# Altium schematic sheet P03_AM335x 1_3, JTAG.SchDoc
size 513 x 386 mm
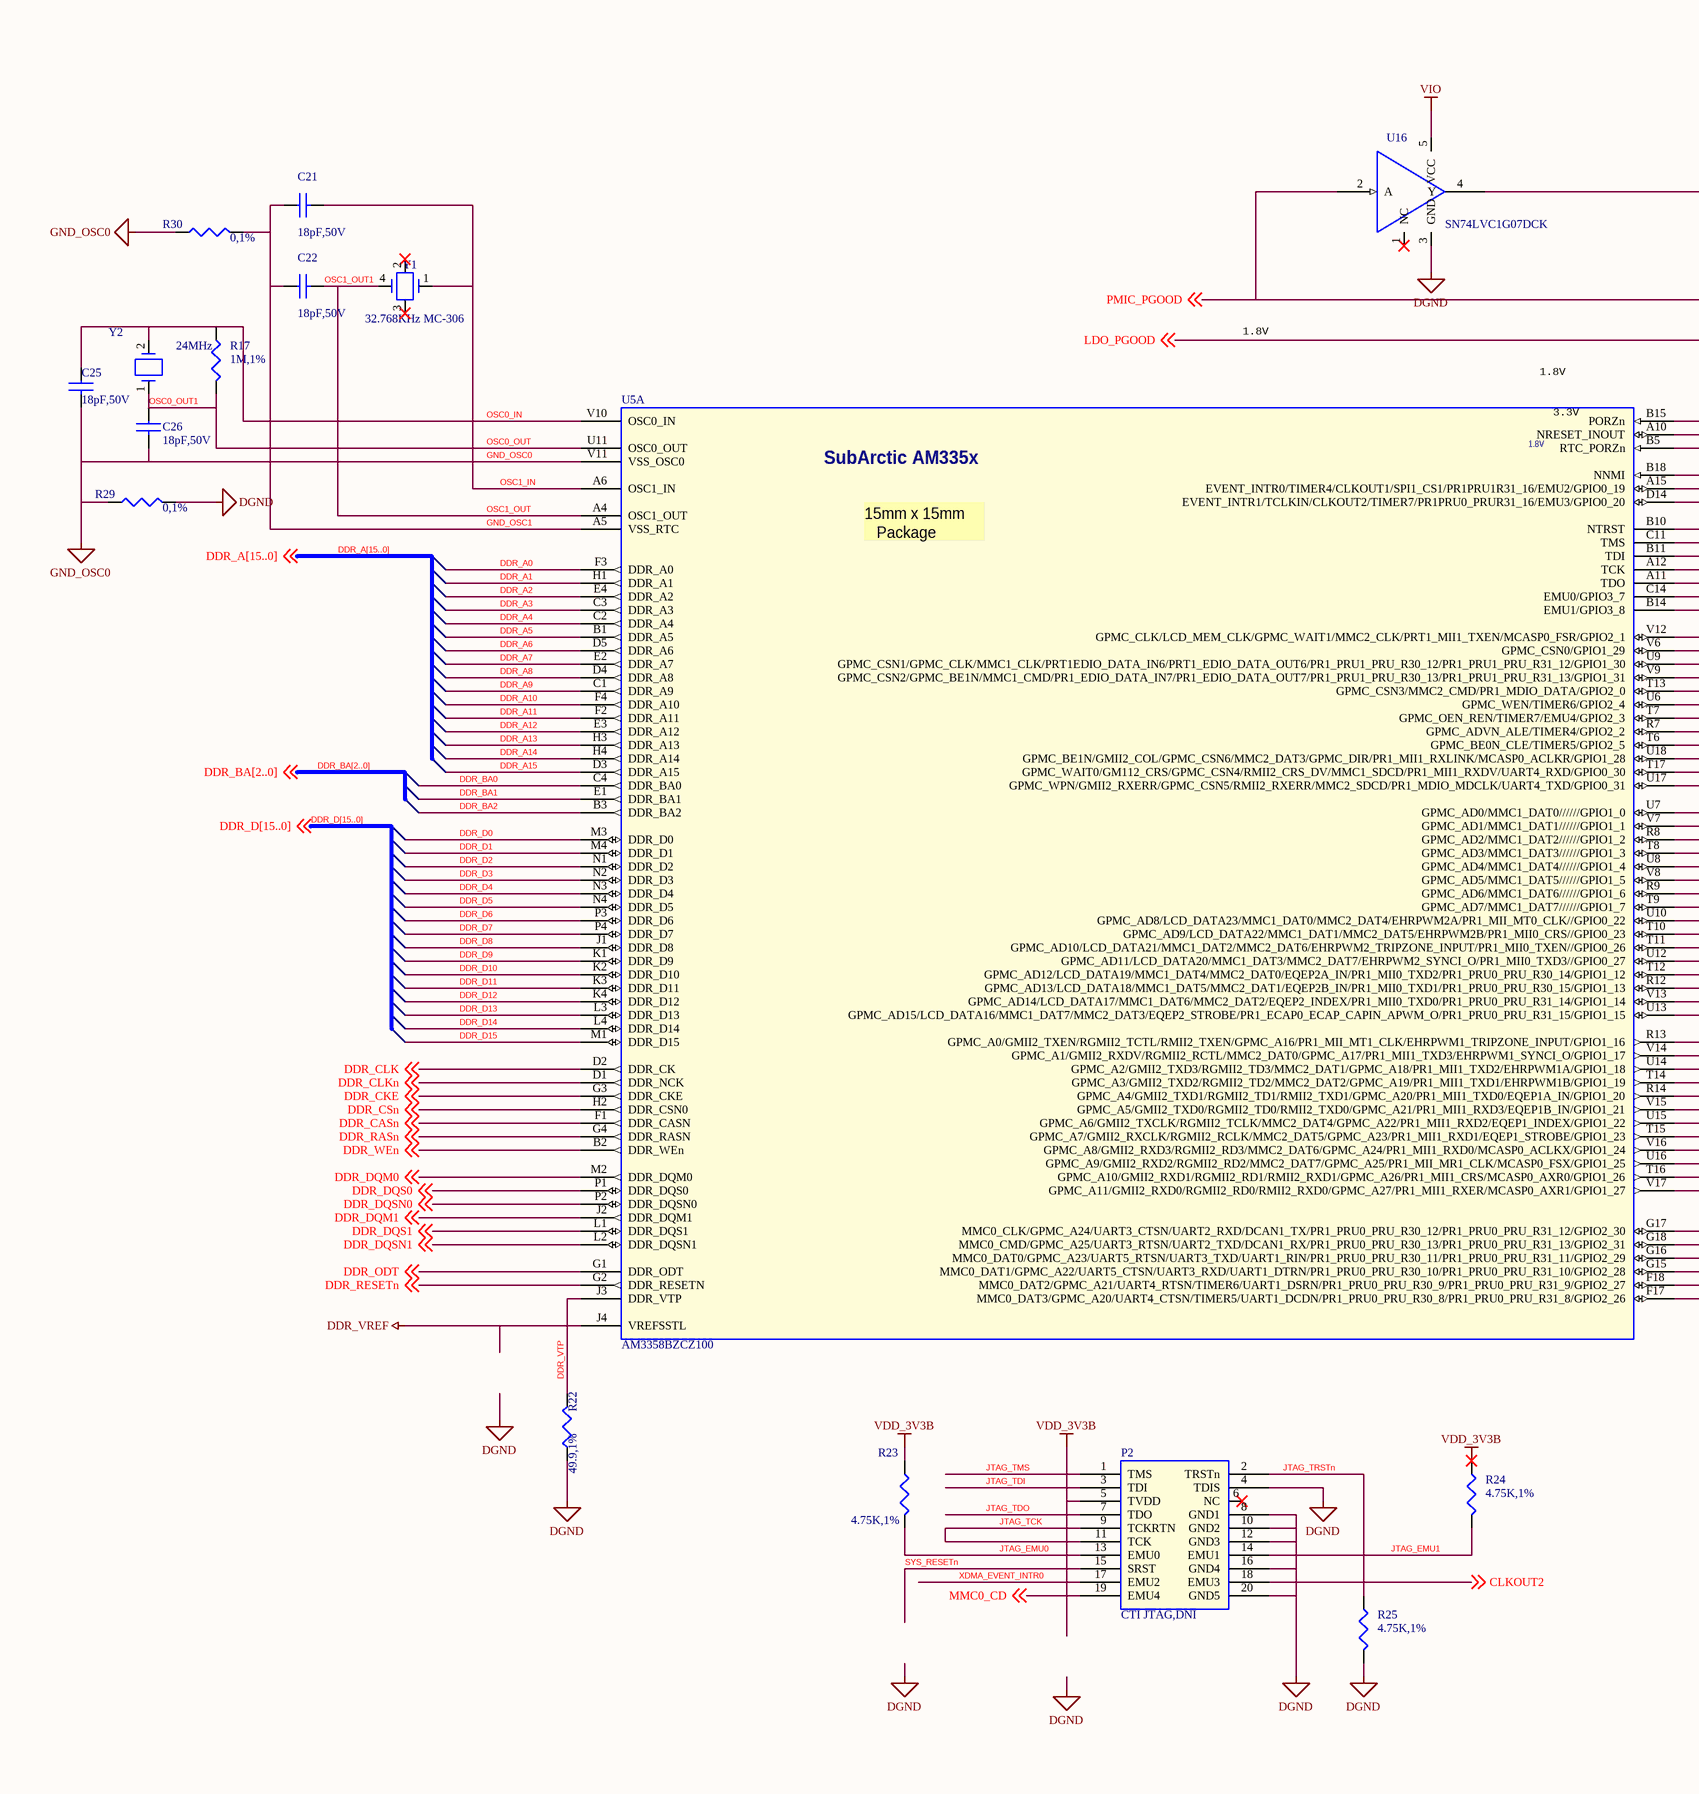
[diagram p0: P03_AM335x 1_3, JTAG.SchDoc, left]
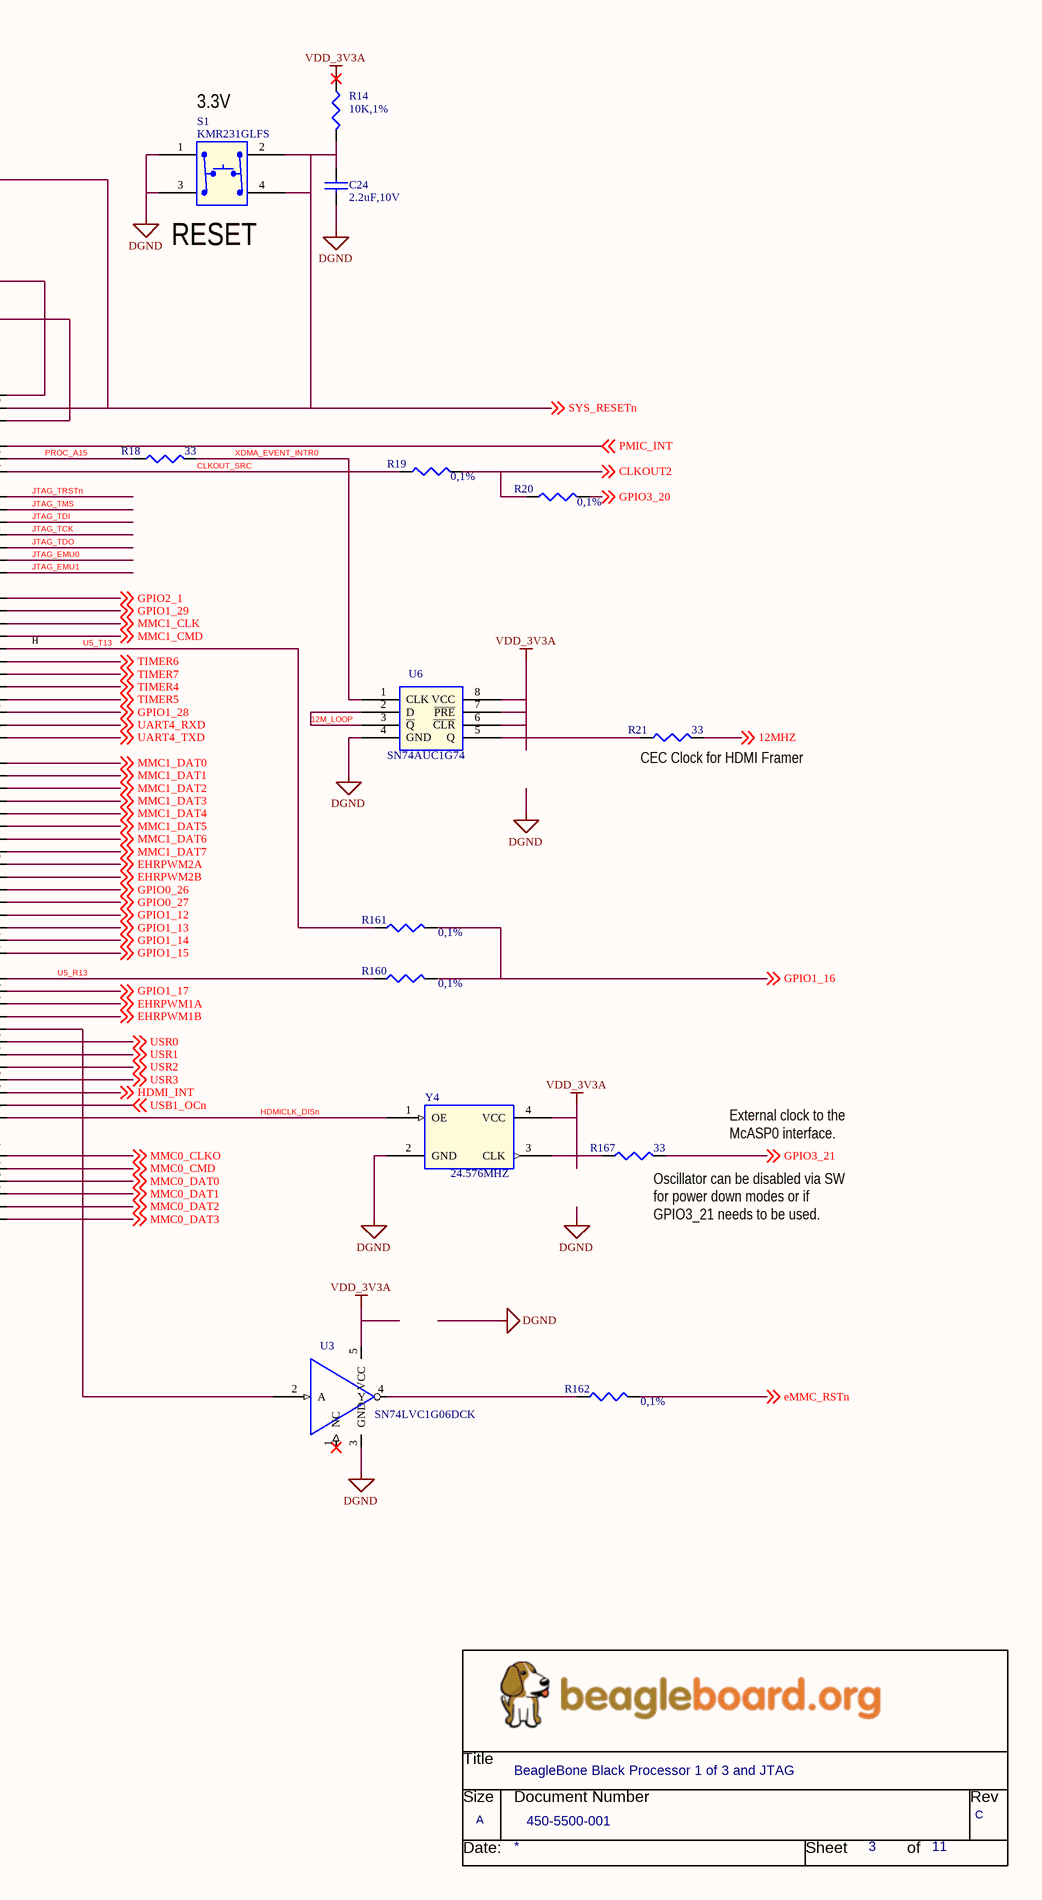
[diagram p1: P03_AM335x 1_3, JTAG.SchDoc, right]

## Parts
*  Page Count: 11  Page Number: 3  Page Size: A  Title: BeagleBone Black Processor 1 of 3 and JTAG  RevCode: C  Doc: 450-5500-001  (hidden comment: BeagleBoard_org)  (graphical)
C21  18pF,50V  [402]
C22  18pF,50V  [402]
C24  2.2uF,10V  [402]
C25  18pF,50V  [402]
C26  18pF,50V  [402]
P2  CTI JTAG,DNI  [header10x2]
R14  10K,1%  [402]
R17  1M,1%  [402]
R18  33  [r402-25rd]
R19  0,1%  [402]
R20  0,1%  [402]
R21  33  [r402-25rd]
R22  49.9,1%  [r402-25rd]
R23  4.75K,1%  [402]
R24  4.75K,1%  [402]
R25  4.75K,1%  [402]
R29  0,1%  [402]
R30  0,1%  [402]
R160  0,1%  [402]
R161  0,1%  [402]
R162  0,1%  [402]
R167  33  [r402-25rd]
S1  KMR231GLFS  [SM-SW-SPST-4-4]
U3  SN74LVC1G06DCK  [DCK5_2P15X1P4]
U5  AM3358BZCZ100  [am33xx_15x15]  (part A of 3)
U6  SN74AUC1G74  [SOP8_DCT]
U16  SN74LVC1G07DCK  [DCK5_2P15X1P4]
Y1  32.768KHz MC-306  [MC-306]
Y2  24MHz  [SM_CRY_SCC18]
Y4  24.576MHZ  [ecs_smd3_2x5mm]

## Nets
DDR_VREF: U5.J4(VREFSSTL)
DGND: C24.2 P2.4(TDIS) P2.8(GND1) P2.10(GND2) P2.12(GND3) P2.16(GND4) P2.20(GND5) R22.1 R25.2 R29.2 S1.1(A1) S1.3(A2) U3.3(GND) U6.4(GND) U16.3(GND) Y4.2(GND)
GND_OSC0: C25.2 C26.2 R29.1 R30.1 U5.V11(VSS_OSC0)
VDD_3V3A: R14.1 U3.5(VCC) U6.6(~{CLR}) U6.7(~{PRE}) U6.8(VCC) Y4.4(VCC)
VDD_3V3B: P2.5(TVDD) R23.1 R24.1
VIO: U16.5(VCC)
12M_LOOP: U6.2(D) U6.3(~{Q})
12MHZ: R21.2 ; off-sheet 12MHZ
CLKOUT2: P2.18(EMU3) R19.2 R20.1 ; off-sheet CLKOUT2
CLKOUT_SRC: R19.1 U5.D14(EVENT_INTR1/TCLKIN/CLKOUT2/TIMER7/PR1PRU0_PRUR31_16/EMU3/GPIO0_20)
DDR_A0: U5.F3(DDR_A0)
DDR_A1: U5.H1(DDR_A1)
DDR_A2: U5.E4(DDR_A2)
DDR_A3: U5.C3(DDR_A3)
DDR_A4: U5.C2(DDR_A4)
DDR_A5: U5.B1(DDR_A5)
DDR_A6: U5.D5(DDR_A6)
DDR_A7: U5.E2(DDR_A7)
DDR_A8: U5.D4(DDR_A8)
DDR_A9: U5.C1(DDR_A9)
DDR_A10: U5.F4(DDR_A10)
DDR_A11: U5.F2(DDR_A11)
DDR_A12: U5.E3(DDR_A12)
DDR_A13: U5.H3(DDR_A13)
DDR_A14: U5.H4(DDR_A14)
DDR_A15: U5.D3(DDR_A15)
DDR_BA0: U5.C4(DDR_BA0)
DDR_BA1: U5.E1(DDR_BA1)
DDR_BA2: U5.B3(DDR_BA2)
DDR_CASn: U5.F1(DDR_CASN) ; off-sheet DDR_CASn
DDR_CKE: U5.G3(DDR_CKE) ; off-sheet DDR_CKE
DDR_CLK: U5.D2(DDR_CK) ; off-sheet DDR_CLK
DDR_CLKn: U5.D1(DDR_NCK) ; off-sheet DDR_CLKn
DDR_CSn: U5.H2(DDR_CSN0) ; off-sheet DDR_CSn
DDR_D0: U5.M3(DDR_D0)
DDR_D1: U5.M4(DDR_D1)
DDR_D2: U5.N1(DDR_D2)
DDR_D3: U5.N2(DDR_D3)
DDR_D4: U5.N3(DDR_D4)
DDR_D5: U5.N4(DDR_D5)
DDR_D6: U5.P3(DDR_D6)
DDR_D7: U5.P4(DDR_D7)
DDR_D8: U5.J1(DDR_D8)
DDR_D9: U5.K1(DDR_D9)
DDR_D10: U5.K2(DDR_D10)
DDR_D11: U5.K3(DDR_D11)
DDR_D12: U5.K4(DDR_D12)
DDR_D13: U5.L3(DDR_D13)
DDR_D14: U5.L4(DDR_D14)
DDR_D15: U5.M1(DDR_D15)
DDR_DQM0: U5.M2(DDR_DQM0) ; off-sheet DDR_DQM0
DDR_DQM1: U5.J2(DDR_DQM1) ; off-sheet DDR_DQM1
DDR_DQS0: U5.P1(DDR_DQS0) ; off-sheet DDR_DQS0
DDR_DQS1: U5.L1(DDR_DQS1) ; off-sheet DDR_DQS1
DDR_DQSN0: U5.P2(DDR_DQSN0) ; off-sheet DDR_DQSN0
DDR_DQSN1: U5.L2(DDR_DQSN1) ; off-sheet DDR_DQSN1
DDR_ODT: U5.G1(DDR_ODT) ; off-sheet DDR_ODT
DDR_RASn: U5.G4(DDR_RASN) ; off-sheet DDR_RASn
DDR_RESETn: U5.G2(DDR_RESETN) ; off-sheet DDR_RESETn
DDR_VTP: R22.2 U5.J3(DDR_VTP)
DDR_WEn: U5.B2(DDR_WEn) ; off-sheet DDR_WEn
EHRPWM1A: U5.U14(GPMC_A2/GMII2_TXD3/RGMII2_TD3/MMC2_DAT1/GPMC_A18/PR1_MII1_TXD2/EHRPWM1A/GPIO1_18) ; off-sheet EHRPWM1A
EHRPWM1B: U5.T14(GPMC_A3/GMII2_TXD2/RGMII2_TD2/MMC2_DAT2/GPMC_A19/PR1_MII1_TXD1/EHRPWM1B/GPIO1_19) ; off-sheet EHRPWM1B
EHRPWM2A: U5.U10(GPMC_AD8/LCD_DATA23/MMC1_DAT0/MMC2_DAT4/EHRPWM2A/PR1_MII_MT0_CLK//GPIO0_22) ; off-sheet EHRPWM2A
EHRPWM2B: U5.T10(GPMC_AD9/LCD_DATA22/MMC1_DAT1/MMC2_DAT5/EHRPWM2B/PR1_MII0_CRS//GPIO0_23) ; off-sheet EHRPWM2B
eMMC_RSTn: R162.2 ; off-sheet eMMC_RSTn
GND_OSC1: C21.1 C22.1 R30.2 U5.A5(VSS_RTC)
GPIO0_26: U5.T11(GPMC_AD10/LCD_DATA21/MMC1_DAT2/MMC2_DAT6/EHRPWM2_TRIPZONE_INPUT/PR1_MII0_TXEN//GPIO0_26) ; off-sheet GPIO0_26
GPIO0_27: U5.U12(GPMC_AD11/LCD_DATA20/MMC1_DAT3/MMC2_DAT7/EHRPWM2_SYNCI_O/PR1_MII0_TXD3//GPIO0_27) ; off-sheet GPIO0_27
GPIO1_12: U5.T12(GPMC_AD12/LCD_DATA19/MMC1_DAT4/MMC2_DAT0/EQEP2A_IN/PR1_MII0_TXD2/PR1_PRU0_PRU_R30_14/GPIO1_12) ; off-sheet GPIO1_12
GPIO1_13: U5.R12(GPMC_AD13/LCD_DATA18/MMC1_DAT5/MMC2_DAT1/EQEP2B_IN/PR1_MII0_TXD1/PR1_PRU0_PRU_R30_15/GPIO1_13) ; off-sheet GPIO1_13
GPIO1_14: U5.V13(GPMC_AD14/LCD_DATA17/MMC1_DAT6/MMC2_DAT2/EQEP2_INDEX/PR1_MII0_TXD0/PR1_PRU0_PRU_R31_14/GPIO1_14) ; off-sheet GPIO1_14
GPIO1_15: U5.U13(GPMC_AD15/LCD_DATA16/MMC1_DAT7/MMC2_DAT3/EQEP2_STROBE/PR1_ECAP0_ECAP_CAPIN_APWM_O/PR1_PRU0_PRU_R31_15/GPIO1_15) ; off-sheet GPIO1_15
GPIO1_16: R160.2 R161.2 ; off-sheet GPIO1_16
GPIO1_17: U5.V14(GPMC_A1/GMII2_RXDV/RGMII2_RCTL/MMC2_DAT0/GPMC_A17/PR1_MII1_TXD3/EHRPWM1_SYNCI_O/GPIO1_17) ; off-sheet GPIO1_17
GPIO1_28: U5.U18(GPMC_BE1N/GMII2_COL/GPMC_CSN6/MMC2_DAT3/GPMC_DIR/PR1_MII1_RXLINK/MCASP0_ACLKR/GPIO1_28) ; off-sheet GPIO1_28
GPIO1_29: U5.V6(GPMC_CSN0/GPIO1_29) ; off-sheet GPIO1_29
GPIO2_1: U5.V12(GPMC_CLK/LCD_MEM_CLK/GPMC_WAIT1/MMC2_CLK/PRT1_MII1_TXEN/MCASP0_FSR/GPIO2_1) ; off-sheet GPIO2_1
GPIO3_20: R20.2 ; off-sheet GPIO3_20
GPIO3_21: R167.2 ; off-sheet GPIO3_21
HDMI_INT: U5.U16(GPMC_A9/GMII2_RXD2/RGMII2_RD2/MMC2_DAT7/GPMC_A25/PR1_MII_MR1_CLK/MCASP0_FSX/GPIO1_25) ; off-sheet HDMI_INT
HDMICLK_DISn: U5.V17(GPMC_A11/GMII2_RXD0/RGMII2_RD0/RMII2_RXD0/GPMC_A27/PR1_MII1_RXER/MCASP0_AXR1/GPIO1_27) Y4.1(OE)
JTAG_EMU0: P2.13(EMU0) R23.2 U5.C14(EMU0/GPIO3_7)
JTAG_EMU1: P2.14(EMU1) R24.2 U5.B14(EMU1/GPIO3_8)
JTAG_TCK: P2.9(TCKRTN) P2.11(TCK) U5.A12(TCK)
JTAG_TDI: P2.3(TDI) U5.B11(TDI)
JTAG_TDO: P2.7(TDO) U5.A11(TDO)
JTAG_TMS: P2.1(TMS) U5.C11(TMS)
JTAG_TRSTn: P2.2(TRSTn) R25.1 U5.B10(NTRST)
LDO_PGOOD: U5.B5(RTC_PORZn) ; off-sheet LDO_PGOOD
MMC0_CD: P2.19(EMU4) ; off-sheet MMC0_CD
MMC0_CLKO: U5.G17(MMC0_CLK/GPMC_A24/UART3_CTSN/UART2_RXD/DCAN1_TX/PR1_PRU0_PRU_R30_12/PR1_PRU0_PRU_R31_12/GPIO2_30) ; off-sheet MMC0_CLKO
MMC0_CMD: U5.G18(MMC0_CMD/GPMC_A25/UART3_RTSN/UART2_TXD/DCAN1_RX/PR1_PRU0_PRU_R30_13/PR1_PRU0_PRU_R31_13/GPIO2_31) ; off-sheet MMC0_CMD
MMC0_DAT0: U5.G16(MMC0_DAT0/GPMC_A23/UART5_RTSN/UART3_TXD/UART1_RIN/PR1_PRU0_PRU_R30_11/PR1_PRU0_PRU_R31_11/GPIO2_29) ; off-sheet MMC0_DAT0
MMC0_DAT1: U5.G15(MMC0_DAT1/GPMC_A22/UART5_CTSN/UART3_RXD/UART1_DTRN/PR1_PRU0_PRU_R30_10/PR1_PRU0_PRU_R31_10/GPIO2_28) ; off-sheet MMC0_DAT1
MMC0_DAT2: U5.F18(MMC0_DAT2/GPMC_A21/UART4_RTSN/TIMER6/UART1_DSRN/PR1_PRU0_PRU_R30_9/PR1_PRU0_PRU_R31_9/GPIO2_27) ; off-sheet MMC0_DAT2
MMC0_DAT3: U5.F17(MMC0_DAT3/GPMC_A20/UART4_CTSN/TIMER5/UART1_DCDN/PR1_PRU0_PRU_R30_8/PR1_PRU0_PRU_R31_8/GPIO2_26) ; off-sheet MMC0_DAT3
MMC1_CLK: U5.U9(GPMC_CSN1/GPMC_CLK/MMC1_CLK/PRT1EDIO_DATA_IN6/PRT1_EDIO_DATA_OUT6/PR1_PRU1_PRU_R30_12/PR1_PRU1_PRU_R31_12/GPIO1_30) ; off-sheet MMC1_CLK
MMC1_CMD: U5.V9(GPMC_CSN2/GPMC_BE1N/MMC1_CMD/PR1_EDIO_DATA_IN7/PR1_EDIO_DATA_OUT7/PR1_PRU1_PRU_R30_13/PR1_PRU1_PRU_R31_13/GPIO1_31) ; off-sheet MMC1_CMD
MMC1_DAT0: U5.U7(GPMC_AD0/MMC1_DAT0//////GPIO1_0) ; off-sheet MMC1_DAT0
MMC1_DAT1: U5.V7(GPMC_AD1/MMC1_DAT1//////GPIO1_1) ; off-sheet MMC1_DAT1
MMC1_DAT2: U5.R8(GPMC_AD2/MMC1_DAT2//////GPIO1_2) ; off-sheet MMC1_DAT2
MMC1_DAT3: U5.T8(GPMC_AD3/MMC1_DAT3//////GPIO1_3) ; off-sheet MMC1_DAT3
MMC1_DAT4: U5.U8(GPMC_AD4/MMC1_DAT4//////GPIO1_4) ; off-sheet MMC1_DAT4
MMC1_DAT5: U5.V8(GPMC_AD5/MMC1_DAT5//////GPIO1_5) ; off-sheet MMC1_DAT5
MMC1_DAT6: U5.R9(GPMC_AD6/MMC1_DAT6//////GPIO1_6) ; off-sheet MMC1_DAT6
MMC1_DAT7: U5.T9(GPMC_AD7/MMC1_DAT7//////GPIO1_7) ; off-sheet MMC1_DAT7
OSC0_IN: C25.1 R17.1 U5.V10(OSC0_IN) Y2.2
OSC0_OUT: C26.1 R17.2 U5.U11(OSC0_OUT) Y2.1  [also labelled OSC0_OUT1]
OSC1_IN: C21.2 U5.A6(OSC1_IN) Y1.1
OSC1_OUT: C22.2 U5.A4(OSC1_OUT) Y1.4  [also labelled OSC1_OUT1]
PMIC_INT: U5.B18(NNMI) ; off-sheet PMIC_INT
PMIC_PGOOD: U5.B15(PORZn) U16.2(A) ; off-sheet PMIC_PGOOD
PROC_A15: R18.1 U5.A15(EVENT_INTR0/TIMER4/CLKOUT1/SPI1_CS1/PR1PRU1R31_16/EMU2/GPIO0_19)
SYS_RESETn: C24.1 P2.15(SRST) R14.2 S1.2(B1) S1.4(B2) U5.A10(NRESET_INOUT) U16.4(Y) ; off-sheet SYS_RESETn
TIMER4: U5.R7(GPMC_ADVN_ALE/TIMER4/GPIO2_2) ; off-sheet TIMER4
TIMER5: U5.T6(GPMC_BE0N_CLE/TIMER5/GPIO2_5) ; off-sheet TIMER5
TIMER6: U5.U6(GPMC_WEN/TIMER6/GPIO2_4) ; off-sheet TIMER6
TIMER7: U5.T7(GPMC_OEN_REN/TIMER7/EMU4/GPIO2_3) ; off-sheet TIMER7
U5_R13: R160.1 U5.R13(GPMC_A0/GMII2_TXEN/RGMII2_TCTL/RMII2_TXEN/GPMC_A16/PR1_MII_MT1_CLK/EHRPWM1_TRIPZONE_INPUT/GPIO1_16)
U5_T13: R161.1 U5.T13(GPMC_CSN3/MMC2_CMD/PR1_MDIO_DATA/GPIO2_0)
UART4_RXD: U5.T17(GPMC_WAIT0/GM112_CRS/GPMC_CSN4/RMII2_CRS_DV/MMC1_SDCD/PR1_MII1_RXDV/UART4_RXD/GPIO0_30) ; off-sheet UART4_RXD
UART4_TXD: U5.U17(GPMC_WPN/GMII2_RXERR/GPMC_CSN5/RMII2_RXERR/MMC2_SDCD/PR1_MDIO_MDCLK/UART4_TXD/GPIO0_31) ; off-sheet UART4_TXD
USB1_OCn: U5.T16(GPMC_A10/GMII2_RXD1/RGMII2_RD1/RMII2_RXD1/GPMC_A26/PR1_MII1_CRS/MCASP0_AXR0/GPIO1_26) ; off-sheet USB1_OCn
USR0: U5.V15(GPMC_A5/GMII2_TXD0/RGMII2_TD0/RMII2_TXD0/GPMC_A21/PR1_MII1_RXD3/EQEP1B_IN/GPIO1_21) ; off-sheet USR0
USR1: U5.U15(GPMC_A6/GMII2_TXCLK/RGMII2_TCLK/MMC2_DAT4/GPMC_A22/PR1_MII1_RXD2/EQEP1_INDEX/GPIO1_22) ; off-sheet USR1
USR2: U5.T15(GPMC_A7/GMII2_RXCLK/RGMII2_RCLK/MMC2_DAT5/GPMC_A23/PR1_MII1_RXD1/EQEP1_STROBE/GPIO1_23) ; off-sheet USR2
USR3: U5.V16(GPMC_A8/GMII2_RXD3/RGMII2_RD3/MMC2_DAT6/GPMC_A24/PR1_MII1_RXD0/MCASP0_ACLKX/GPIO1_24) ; off-sheet USR3
XDMA_EVENT_INTR0: P2.17(EMU2) R18.2 U6.1(CLK)
NetR21_1: R21.1 U6.5(Q)
NetR162_1: R162.1 U3.4(Y)
NetR167_1: R167.1 Y4.3(CLK)
NetU3_2: U3.2(A) U5.R14(GPMC_A4/GMII2_TXD1/RGMII2_TD1/RMII2_TXD1/GPMC_A20/PR1_MII1_TXD0/EQEP1A_IN/GPIO1_20)

Not connected (* = marked no-connect by the designer): P2 6(NC)*; U3 1(NC)*; U16 1(NC)*; Y1 2* 3*

## Buses and harness runs
bus DDR_A[15..0]
bus DDR_BA[2..0]
bus DDR_D[15..0]

## Notes on the sheet
- (near S1) 3.3V
- (near S1) RESET
- 1.8V
- (near U5) 1.8V
- (near U5) 3.3V
- H
- (near R21) CEC Clock for HDMI Framer
- External clock to the
  McASP0 interface.
- (near R167) Oscillator can be disabled via SW
  for power down modes or if
  GPIO3_21 needs to be used.
- (in symbol BeagleBoard_org) Title; Size; Document Number; Rev; Date:; Sheet; of
- (in symbol IC_AM335X_ZCZ, part A) 1.8V; SubArctic AM335x; 15mm x 15mm / Package

## Library data of the parts
C21 C22 C25 C26 = CAP_18PF_COG_50V_5%_0402: Desc: CAP, CER, X7R, 0402, 50V, 10%, 0.1uF; Part Number: CAP_18PF_COG_50V_5%_0402; PCB Footprint: 402
C24 = CAP_1.0UF_X5R_10V_10%_0402: Desc: CAP, CER, X7R, 0402, 50V, 10%, 0.1uF; Part Number: CAP_1.0uF_X5R_10V_10%_0402; PCB Footprint: 402
P2 = HDR_10x2_CJTAG_0: Dual Line Header 10x2pin Tin; PartName: HEADERCTIJTAG10x2Pin; Mfr: Samtec; MfrNum: FTR-110-03-G-D-06; TIIntPartnumber: 2H0039; Cost100: 1.20; Cost10K: 0.97; PCB Footprint: SMD10x2Pin0.050in; Vendor: Samtec
R14 = RES_10K_1/16W_1%_0402_Dup1: Resistor 10Kohm 1/16W 1% 0402; Part Number: RES_10K_1/16W_1%_0402; PCB Footprint: 402
R17 = RES_1M_1/16W_1%_0402: Resistor 1Mohm 1/16W 1% 0402; Part Number: RES_1M_1/16W_1%_0402; PCB Footprint: 402
R18 R21 R167 = RES_33_0402: PCB Footprint: 0402; Part Number: RES_33_0402
R19 R20 R29 R30 = RES_0_1/16W_1%_0402_Dup1: Resistor Zero ohm Jumper 0402; Part Number: RES_0_1/16W_1%_0402; PCB Footprint: 402
R22 = RES_4.7K_0402: PCB Footprint: 402
R23-R25 R160-R162 = RES_4.75K_1/16W_1%_0402: RES 4.75K OHM 1/16W 1% 0402 SMD; Part Number: RES_4.75K_1/16W_1%_0402; PCB Footprint: 402
S1 = SW_KT11P2JM_2: CLASS: DISCRETE; TN: 276-0043-000; PCB Footprint: SW4SMD_63X161LS
U3 = IC_SN74LVC1G06DCK_0: PCB Footprint: DCK5_2P15X1P4
U5 = IC_AM335X_ZCZ: SubArctic Cortex A8 Processor 15x15; Part Number: IC_AM335x_ZCE; TIIntPartnumber: 1A0242; MfrNum: AM335x 15x15 FBGA ZCE; Mfr: TI; PartName: AM335X_15x15; PCB Footprint: FBGAZCZ15x15_tbd; Vendor: Arrow; Cost10K: 10.00; Cost100: 10.00
U6 = IC_SN74AUC1G74: PCB Footprint: SOP8_DCT
U16 = IC_SN74LVC1G07DCK: Part Number: IC_SN74LVC1G07DCK; PCB Footprint: DCK5_2P15X1P4
Y1 = CRYS_32_768KHz_SMD32_1: Crystal 32.768KHz; PartName: Crystal32.768KHzMC306; Mfr: Epson; MfrNum: MC-30632.7680k-A; TIIntPartnumber: 1Y0029; TN: tbd; Vendor: Digikey; Cost100: 0.41; Cost10K: 0.338; PCB Footprint: smd
Y2 = CRYS_24MHz_SCC_0: Crystal 24MHz; TIIntPartnumber: 1Y0033; MfrNum: SCC18B-24.000MHz TR; Mfr: Suntsu; PartName: Crystal24MHzSCC; Cost10K: 0.51; Cost100: 0.90; Vendor: Suntsu Inc; PCB Footprint: SM_CRY_SCC18
Y4 = OSC_12MHz_1.3V: Oscillator 12MHz 50ppm SMD 1.8V; TIIntPartnumber: 1Y0028; MfrNum: ECS-3518-120-B-TR; Mfr: ECS; PartName: Oscillator12MHzSMD; PCB Footprint: SMD 5x3.2mm; Cost10K: 1.12; Cost100: 2.46; Vendor: Digikey; Descriptive_Text: Oscillator 12MHz 50ppm SMD 1.8V; DescriptiveText: Oscillator 12MHz 50ppm SMD 1.8V
* = BeagleBoard_org: Page Create Date: March  8, 1995; Page Modify Date: *